# EAGLE design Black_Box_Sensor (EAGLE 9.6.2)
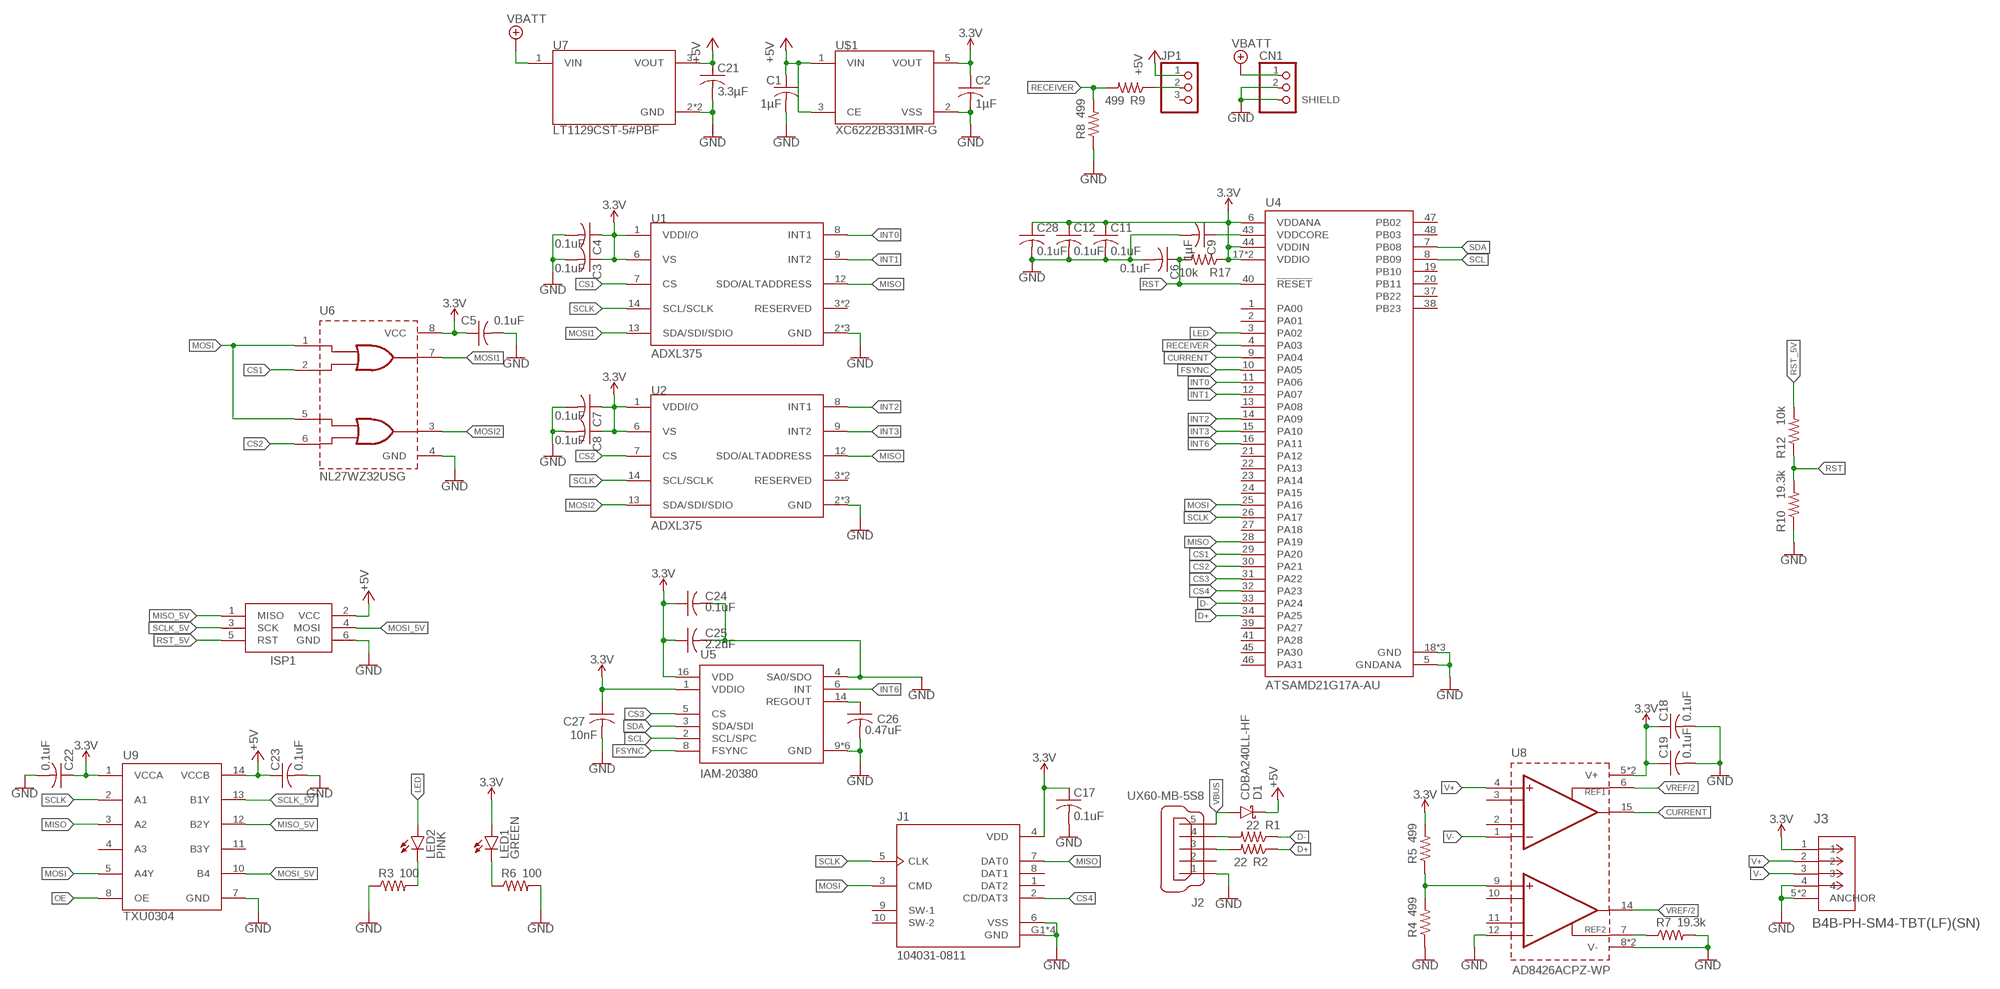
[diagram p0: schematic, sheet 1]

## Parts
C1  1µF  C-USC0603  [C0603]
C2  1µF  C-USC0603  [C0603]
C3  0.1uF  C-USC0603  [C0603]
C4  0.1uF  C-USC0603  [C0603]
C5  0.1uF  C-USC0603  [C0603]
C6  0.1uF  C-USC0603  [C0603]
C7  0.1uF  C-USC0603  [C0603]
C8  0.1uF  C-USC0603  [C0603]
C9  1µF  C-USC0603  [C0603]
C11  0.1uF  C-USC0603  [C0603]
C12  0.1uF  C-USC0603  [C0603]
C17  0.1uF  C-USC0603  [C0603]
C18  0.1uF  C-USC0603  [C0603]
C19  0.1uF  C-USC0603  [C0603]
C21  3.3µF  C-USC0603  [C0603]
C22  0.1uF  C-USC0603K  [C0603K]
C23  0.1uF  C-USC0603K  [C0603K]
C24  0.1uF  C-USC0603  [C0603]
C25  2.2uF  C-USC0603  [C0603]
C26  0.47uF  C-USC0603  [C0603]
C27  10nF  C-USC0603  [C0603]
C28  0.1uF  C-USC0603  [C0603]
CN1  JST_2PIN  [JST-PH-2-SMT]
D1  CDBA240LL-HF  [DIOM5225X250N]
ISP1  AVRISP-6  [AVRISP]
J1  104031-0811  [MOLEX_104031-0811]
J2  UX60-MB-5S8  [UX60-MB-5S8]
J3  B4B-PH-SM4-TBT(LF)(SN)  [CONN_B4B-PH-SM4-TB_JST]
JP1  PINHD-1X3  [1X03]
LED1  GREEN  LEDCHIP-LED0805  [CHIP-LED0805]
LED2  PINK  LEDKA-3528ASYC  [KA-3528ASYC]
R1  22  R-US_R0603  [R0603]
R2  22  R-US_R0603  [R0603]
R3  100  R-US_R0603  [R0603]
R4  499  R-US_R0603  [R0603]
R5  499  R-US_R0603  [R0603]
R6  100  R-US_R0603  [R0603]
R7  19.3k  R-US_R0603  [R0603]
R8  499  R-US_R0603  [R0603]
R9  499  R-US_R0603  [R0603]
R10  19.3k  R-US_R0603  [R0603]
R12  10k  R-US_R0603  [R0603]
R17  10k  R-US_R0603  [R0603]
U1  ADXL375  [14-VFLGA]
U2  ADXL375  [14-VFLGA]
U4  ATSAMD21G17A-AU  [TQFP48]
U5  IAM-20380  [PQFN50P300X300X80-16N]
U6  NL27WZ32USG  [US8]
U7  LT1129CST-5#PBF  [SOT-223-3]
U8  AD8426ACPZ-WP  [16LFCSP]
U9  TXU0304  [TSSOP14]
U$1  XC6222B331MR-G  [SOT-25]

## Nets
3.3V: C2.1 C3.1 C4.1 C5.1 C7.1 C8.1 C11.1 C12.1 C17.1 C18.1 C19.1 C22.1 C24.1 C25.1 C27.1 C28.1 J1.4(VDD) J3.1 LED1.A R5.2 R17.1 U1.1(VDDI/O) U1.6(VS) U2.1(VDDI/O) U2.6(VS) U4.6(VDDANA) U4.17(VDDIO) U4.36(VDDIO) U4.44(VDDIN) U5.1(VDDIO) U5.16(VDD) U6.8(VCC) U8.5(V+) U8.16(V+) U9.1(VCCA) U$1.5(VOUT)
+5V: C1.1 C21.1 C23.1 D1.C JP1.1 U7.3(VOUT) U9.14(VCCB) U$1.1(VIN) U$1.3(CE)
CS1: U1.7(CS) U4.29(PA20) U6.2(B1)
CS2: U2.7(CS) U4.30(PA21) U6.6(B2)
CS3: U4.31(PA22) U5.5(CS)
CS4: J1.2(CD/DAT3) U4.32(PA23)
CURRENT: U4.9(PA04) U8.15(OUTA)
D+: R2.1 U4.34(PA25)
D-: R1.1 U4.33(PA24)
FSYNC: U4.10(PA05) U5.8(FSYNC)
GND: C1.2 C2.2 C3.2 C4.2 C5.2 C6.2 C7.2 C8.2 C9.2 C11.2 C12.2 C17.2 C18.2 C19.2 C21.2 C22.2 C23.2 C24.2 C25.2 C26.2 C27.2 C28.2 CN1.2 CN1.NC1(SHIELD) CN1.NC2(SHIELD) ISP1.6(GND) J1.6(VSS) J1.G1(GND) J1.G2(GND) J1.G3(GND) J1.G4(GND) J2.1 J3.4 J3.5(ANCHOR) J3.6(ANCHOR) R3.1 R4.1 R6.2 R7.2 R8.1 R10.1 U1.2(GND) U1.4(GND) U1.5(GND) U2.2(GND) U2.4(GND) U2.5(GND) U4.5(GNDANA) U4.18(GND) U4.35(GND) U4.42(GND) U5.4(SA0/SDO) U5.9(GND) U5.10(GND) U5.11(GND) U5.12(GND) U5.13(GND) U5.15(GND) U6.4(GND) U7.2(GND) U7.4(GND) U8.8(V-) U8.12(INB-) U8.13(V-) U9.7(GND) U$1.2(VSS)
INT0: U1.8(INT1) U4.11(PA06)
INT1: U1.9(INT2) U4.12(PA07)
INT2: U2.8(INT1) U4.14(PA09)
INT3: U2.9(INT2) U4.15(PA10)
INT6: U4.16(PA11) U5.6(INT)
LED: LED2.A U4.3(PA02)
MISO: J1.7(DAT0) U1.12(SDO/ALTADDRESS) U2.12(SDO/ALTADDRESS) U4.28(PA19) U9.3(A2)
MISO_5V: ISP1.1(MISO) U9.12(B2Y)
MOSI: J1.3(CMD) U4.25(PA16) U6.1(A1) U6.5(A2) U9.5(A4Y)
MOSI1: U1.13(SDA/SDI/SDIO) U6.7(Y1)
MOSI2: U2.13(SDA/SDI/SDIO) U6.3(Y2)
MOSI_5V: ISP1.4(MOSI) U9.10(B4)
N$1: C9.1 U4.43(VDDCORE)
N$2: J2.3 R2.2
N$3: J2.4 R1.2
N$4: R4.2 R5.1 U8.9(INB+)
N$5: LED2.C R3.2
N$6: LED1.C R6.1
N$7: JP1.2 R9.1
N$8: R7.1 U8.7(REFB)
N$9: ISP1.2(VCC) ; supply symbol labelled +5V
N$10: C26.1 U5.14(REGOUT)
OE: U9.8(OE)
RECEIVER: R8.2 R9.2 U4.4(PA03)
RST: C6.1 R10.2 R12.1 R17.2 U4.40(!RESET!)
RST_5V: ISP1.5(RST) R12.2
SCL: U4.8(PB09) U5.2(SCL/SPC)
SCLK: J1.5(CLK) U1.14(SCL/SCLK) U2.14(SCL/SCLK) U4.26(PA17) U9.2(A1)
SCLK_5V: ISP1.3(SCK) U9.13(B1Y)
SDA: U4.7(PB08) U5.3(SDA/SDI)
V+: J3.2 U8.4(INA+)
V-: J3.3 U8.1(INA-)
VBATT: CN1.1 U7.1(VIN)
VBUS: D1.A J2.5
VREF/2: U8.6(REFA) U8.14(OUTB)
Unconnected: J1.1(DAT2) J1.8(DAT1) J1.9(SW-1) J1.10(SW-2) J2.2 JP1.3 U1.3(RESERVED) U1.11(RESERVED) U2.3(RESERVED) U2.11(RESERVED) U4.1(PA00) U4.2(PA01) U4.13(PA08) U4.19(PB10) U4.20(PB11) U4.21(PA12) U4.22(PA13) U4.23(PA14) U4.24(PA15) U4.27(PA18) U4.37(PB22) U4.38(PB23) U4.39(PA27) U4.41(PA28) U4.45(PA30) U4.46(PA31) U4.47(PB02) U4.48(PB03) U8.2(RGA-) U8.3(RGA+) U8.10(RGB+) U8.11(RGB-) U9.4(A3) U9.11(B3Y)

## Library data of the parts
C1 C2 C9 C21 = rcl:C-US: CAPACITOR, American symbol; DKPN: CC0603KRX7R6BB105; SPICEPREFIX: C; VOLTAGE: 10V
C3 C4 C6-C8 C11 C12 C17-C19 C24 C28 = rcl:C-US: CAPACITOR, American symbol; DKPN: CGA3E2X7R1E104K080AA; SPICEPREFIX: C
C5 C22 C23 = rcl:C-US: CAPACITOR, American symbol; SPICEPREFIX: C
C25 = rcl:C-US: CAPACITOR, American symbol; DKPN: C1608X5R1C225K080AB; SPICEPREFIX: C
C26 = rcl:C-US: CAPACITOR, American symbol; DKPN: C0603X5R0J474M030BC; SPICEPREFIX: C
C27 = rcl:C-US: CAPACITOR, American symbol; DKPN: C1608X7R2A103M080AA; SPICEPREFIX: C
CN1 = Hocki_Library:JST_2PIN: JST 2-Pin Connectors of various flavors SMT-RA (S2B-PH-SM4) 4UConnector #17311 SMT (B2B-PH-SM4) THM-RA (S2B-PH) THM (B2B-PH)
D1 = BBS_Library:CDBA240LL-HF: 40V, 2A Schottky diode with 1mA reverse leakage current and 350mV forward voltage. Datasheet <https://www.comchiptech.com/admin/files/product/CDBA240LL-HF%20RevD765674.pdf>; DKPN: 641-1698-1-ND
ISP1 = adafruit:AVRISP: AVR ISP HEADER Standard 6 pin header for AVR programming
J1 = BBS_Library:104031-0811: 10 (8 + 2) Position Card Connector Secure Digital - microSD™ Surface Mount, Right Angle Gold Datasheet <https://www.molex.com/pdm_docs/sd/1040310811_sd.pdf>; DKPN: WM6357CT-ND
J2 = BBS_Library:UX60*-MB-5S?: Description: USB - mini B USB 2.0 Receptacle Connector 5 Position, Right Angle Link SMD: Digi-Key <https://www.digikey.com/product-detail/en/hirose-electric-co-ltd/UX60A-MB-5ST/H2961CT-ND/597540> Link Through Hole: Digi-Key <https://www.digikey.com/products/en/connectors-interconnects/usb-dvi-hdmi-connectors/312?k=UX60-MB-5S8&k=&pkeyword=UX60-MB-5S8&sv=0&pv7=2&sf=0&quantity=&ColumnSort=0&page=1&pageSize=25>; DKPN: H2960CT-ND
J3 = BBS_Library:B4B-PH-SM4-TBT(LF)(SN): Connector Header Surface Mount 4 position 0.079" (2.00mm) DigiKey <https://www.digikey.com/en/products/detail/jst-sales-america-inc/B4B-PH-SM4-TBT-LF-SN/2217689?s=N4IgjCBcoBw1oDGUBmBDANgZwKYBoQB7KAbRACYAGAZjADYB2EAXQIAcAXKEAZQ4CcAlgDsA5iAC%2BBMAE4YMhCGSR02fEVIhKLdl0i8BI8VJABacouUCAruuKQyAVhYSTFhyABWWDgAI2ABY6IHSKggAm3KZglBC63CAEAI4cAJ7ccSBpbDjcaFjIrkA>; DKPN: 455-2873-1-ND
JP1 = pinhead:PINHD-1X3: PIN HEADER
LED1 = led:LED: LED OSRAM: - CHIPLED LG R971, LG N971, LY N971, LG Q971, LY Q971, LO R971, LY R971 LH N974, LH R974 LS Q976, LO Q976, LY Q976 LO Q996 - Hyper CHIPLED LW Q18S LB Q993, LB Q99A, LB R99A - SideLED LS A670, LO A670, LY A670, LG A670, LP A670 LB A673, LV A673, LT A673, LW A673 LH A674 LY A675 LS A676, LA A676, LO A676, LY A676, LW A676 LS A679, LY A679, LG A679 - Hyper Micro SIDELED® LS Y876, LA Y876, LO Y876, LY Y876 LT Y87S - SmartLED LW L88C, LW L88S LB L89C, LB L89S, LG L890 LS L89K, LO L89K, LY L89K LS L896, LA L896, LO L896, LY L896 - TOPLED LS T670, LO T670, LY T670, LG T670, LP T670 LSG T670, LSP T670, LSY T670, LOP T670, LYG T670 LG T671, LOG T671, LSG T671 LB T673, LV T673, LT T673, LW T673 LH T674 LS T676, LA T676, LO T676, LY T676, LB T676, LH T676, LSB T676, LW T676 LB T67C, LV T67C, LT T67C, LS T67K, LO T67K, LY T67K, LW E67C LS E67B, LA E67B, LO E67B, LY E67B, LB E67C, LV E67C, LT E67C LW T67C LS T679, LY T679, LG T679 LS T770, LO T770, LY T770, LG T770, LP T770 LB T773, LV T773, LT T773, LW T773 LH T774 LS E675, LA E675, LY E675, LS T675 LS T776, LA T776, LO T776, LY T776, LB T776 LHGB T686 LT T68C, LB T68C - Hyper Mini TOPLED® LB M676 - Mini TOPLED Santana® LG M470 LS M47K, LO M47K, LY M47K Source: http://www.osram.convergy.de LUXEON: - LUMILED® LXK2-PW12-R00, LXK2-PW12-S00, LXK2-PW14-U00, LXK2-PW14-V00 LXK2-PM12-R00, LXK2-PM12-S00, LXK2-PM14-U00 LXK2-PE12-Q00, LXK2-PE12-R00, LXK2-PE12-S00, LXK2-PE14-T00, LXK2-PE14-U00 LXK2-PB12-K00, LXK2-PB12-L00, LXK2-PB12-M00, LXK2-PB14-N00, LXK2-PB14-P00, LXK2-PB14-Q00 LXK2-PR12-L00, LXK2-PR12-M00, LXK2-PR14-Q00, LXK2-PR14-R00 LXK2-PD12-Q00, LXK2-PD12-R00, LXK2-PD12-S00 LXK2-PH12-R00, LXK2-PH12-S00 LXK2-PL12-P00, LXK2-PL12-Q00, LXK2-PL12-R00 Source: www.luxeon.com KINGBRIGHT: KA-3528ASYC Source: www.kingbright.com; DJKPN: 3372-0805YGBD008S01TR-ND
LED2 = led:LED: LED OSRAM: - CHIPLED LG R971, LG N971, LY N971, LG Q971, LY Q971, LO R971, LY R971 LH N974, LH R974 LS Q976, LO Q976, LY Q976 LO Q996 - Hyper CHIPLED LW Q18S LB Q993, LB Q99A, LB R99A - SideLED LS A670, LO A670, LY A670, LG A670, LP A670 LB A673, LV A673, LT A673, LW A673 LH A674 LY A675 LS A676, LA A676, LO A676, LY A676, LW A676 LS A679, LY A679, LG A679 - Hyper Micro SIDELED® LS Y876, LA Y876, LO Y876, LY Y876 LT Y87S - SmartLED LW L88C, LW L88S LB L89C, LB L89S, LG L890 LS L89K, LO L89K, LY L89K LS L896, LA L896, LO L896, LY L896 - TOPLED LS T670, LO T670, LY T670, LG T670, LP T670 LSG T670, LSP T670, LSY T670, LOP T670, LYG T670 LG T671, LOG T671, LSG T671 LB T673, LV T673, LT T673, LW T673 LH T674 LS T676, LA T676, LO T676, LY T676, LB T676, LH T676, LSB T676, LW T676 LB T67C, LV T67C, LT T67C, LS T67K, LO T67K, LY T67K, LW E67C LS E67B, LA E67B, LO E67B, LY E67B, LB E67C, LV E67C, LT E67C LW T67C LS T679, LY T679, LG T679 LS T770, LO T770, LY T770, LG T770, LP T770 LB T773, LV T773, LT T773, LW T773 LH T774 LS E675, LA E675, LY E675, LS T675 LS T776, LA T776, LO T776, LY T776, LB T776 LHGB T686 LT T68C, LB T68C - Hyper Mini TOPLED® LB M676 - Mini TOPLED Santana® LG M470 LS M47K, LO M47K, LY M47K Source: http://www.osram.convergy.de LUXEON: - LUMILED® LXK2-PW12-R00, LXK2-PW12-S00, LXK2-PW14-U00, LXK2-PW14-V00 LXK2-PM12-R00, LXK2-PM12-S00, LXK2-PM14-U00 LXK2-PE12-Q00, LXK2-PE12-R00, LXK2-PE12-S00, LXK2-PE14-T00, LXK2-PE14-U00 LXK2-PB12-K00, LXK2-PB12-L00, LXK2-PB12-M00, LXK2-PB14-N00, LXK2-PB14-P00, LXK2-PB14-Q00 LXK2-PR12-L00, LXK2-PR12-M00, LXK2-PR14-Q00, LXK2-PR14-R00 LXK2-PD12-Q00, LXK2-PD12-R00, LXK2-PD12-S00 LXK2-PH12-R00, LXK2-PH12-S00 LXK2-PL12-P00, LXK2-PL12-Q00, LXK2-PL12-R00 Source: www.luxeon.com KINGBRIGHT: KA-3528ASYC Source: www.kingbright.com; DJKPN: 754-1534-1-ND
R1 R2 R4 R5 R7-R10 R12 R17 = rcl:R-US_: RESISTOR, American symbol; SPICEPREFIX: R
R3 R6 = rcl:R-US_: RESISTOR, American symbol; DJKPN: 118-CR0603AFX-1000ELFCT-ND; SPICEPREFIX: R
U1 U2 = BBS_Library:ADXL375: Accelerometer X, Y, Z Axis ±200g 0.05Hz ~ 1.6kHz 14-LGA (3x5) Digikey <https://www.digikey.com/en/products/detail/analog-devices-inc/ADXL375BCCZ-RL7/4376405>; DKPN: ADXL375BCCZ-RL7CT-ND
U4 = BBS_Library:ATSAMD21G17A: ARM-Based Microcontroller; CENTROID_NOT_SPECIFIED: No; DATASHEET: http://www.atmel.com/images/atmel-42181-sam-d21_datasheet.pdf; DIGIKEY_DESCRIPTION: IC MCU 32BIT 128KB FLASH 48TQFP; DIGIKEY_PART_NUMBER: 1611-ATSAMD21G17A-AU-ND; LEAD_FREE: yes; MF: Microchip Technology / Atmel; MOUSER_PART_NUMBER: 556-ATSAMD21G17A-AU; MPN: ATSAMD21G17A-AU; PACKAGE: TQFP48; PREFIX: U; RECOMMENDED_LAND_PATTERN: http://www.atmel.com/Images/Atmel-8826-SEEPROM-PCB-Mounting-Guidelines-Surface-Mount-Packages-ApplicationNote.pdf; ROHS: yes; TEMPERATURE_RANGE_HIGH: +85°C; TEMPERATURE_RANGE_LOW: -40°C; VOLTAGE: 3.6V
U5 = BBS_Library:IAM-20380: Gyroscope X (Pitch), Y (Roll), Z (Yaw) ±250, 500, 1000, 2000 27kHz I²C, SPI 16-LGA (3x3) VDD = 1.8V Datasheet <https://invensense.tdk.com/wp-content/uploads/2017/11/DS-000195-IAM-20380_v1.0-Typ.pdf?ref_disty=digikey>; DKPN: 1428-1153-2-ND
U6 = Hocki_Library:NL27WZ32USG: OR Gate IC 2 Channel US8 DigiKey <https://www.digikey.com/product-detail/en/on-semiconductor/NL27WZ32USG/NL27WZ32USGOSCT-ND/964591>; DKPN: NL27WZ32USGOSCT-ND
U7 = BBS_Library:LT1129CST-*#PBF: Linear Voltage Regulator IC Positive Fixed 1 Output 700mA SOT-223-5 Datasheet <https://www.analog.com/media/en/technical-documentation/data-sheets/112935ff.pdf>; DKPN: LT1129CST-5#PBF-ND
U8 = BBS_Library:AD8426ACPZ-WP: IC INST AMP 2 CIRCUIT 16LFCSP DigiKey <https://www.digikey.com/en/products/detail/analog-devices-inc/AD8426ACPZ-WP/2742222>; DKPN: AD8426ACPZ-WP-ND
U9 = BBS_Library:TXU0304: Voltage Level Translator Unidirectional 1 Circuit 4 Channel 200Mbps 14-WQFN (3x2.5) https://www.ti.com/lit/ds/symlink/txu0304.pdf?ts=1646321006193&ref_url=https%253A%252F%252Fwww.mouser.com%252F; DKPN: 296-TXU0304BQARCT-ND
U$1 = BBS_Library:XC6222B331MR-G: Linear Voltage Regulator IC Positive Fixed 3.3V Output 700mA SOT-25-5

## Board
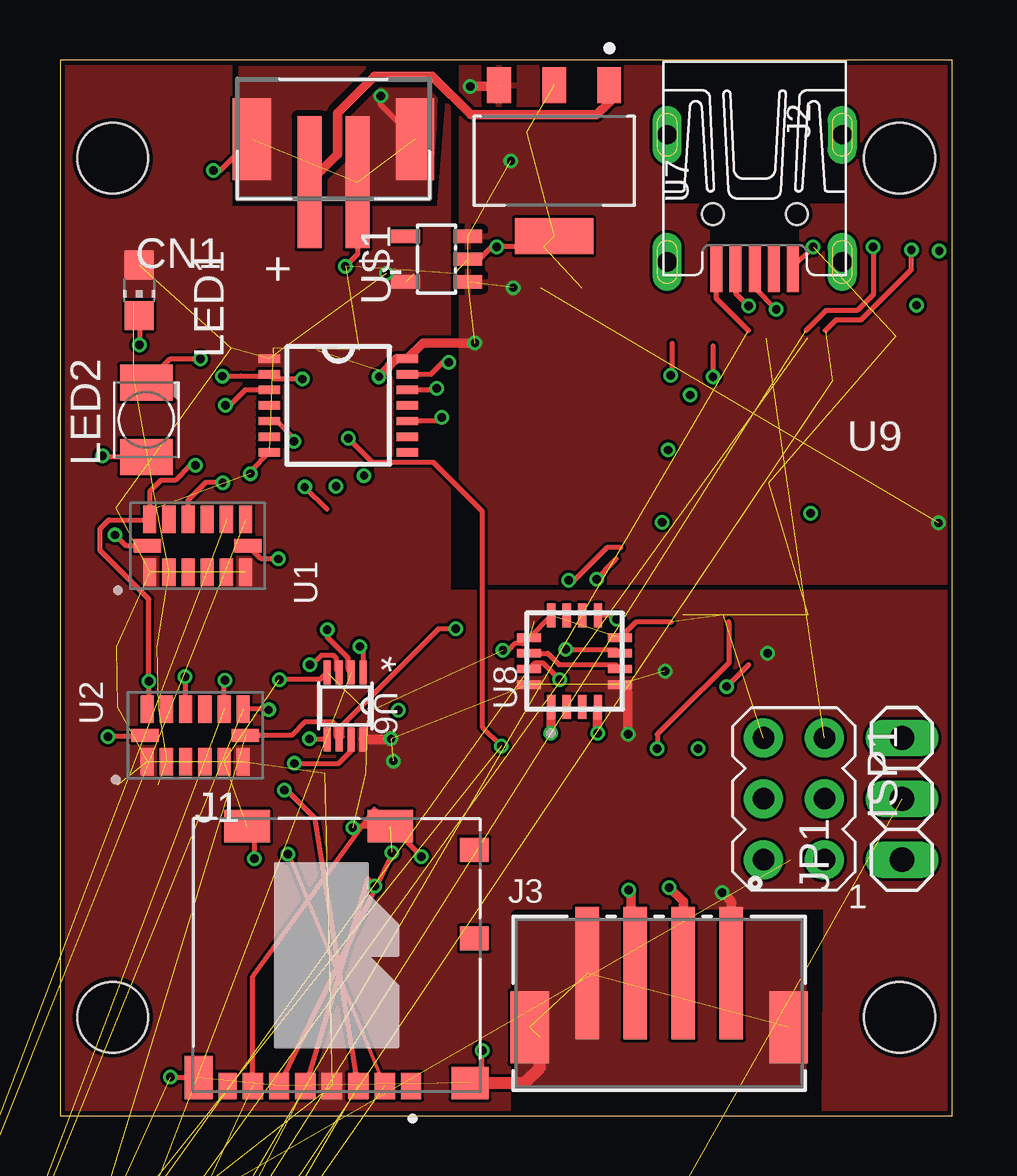
[diagram p1: board, top side]
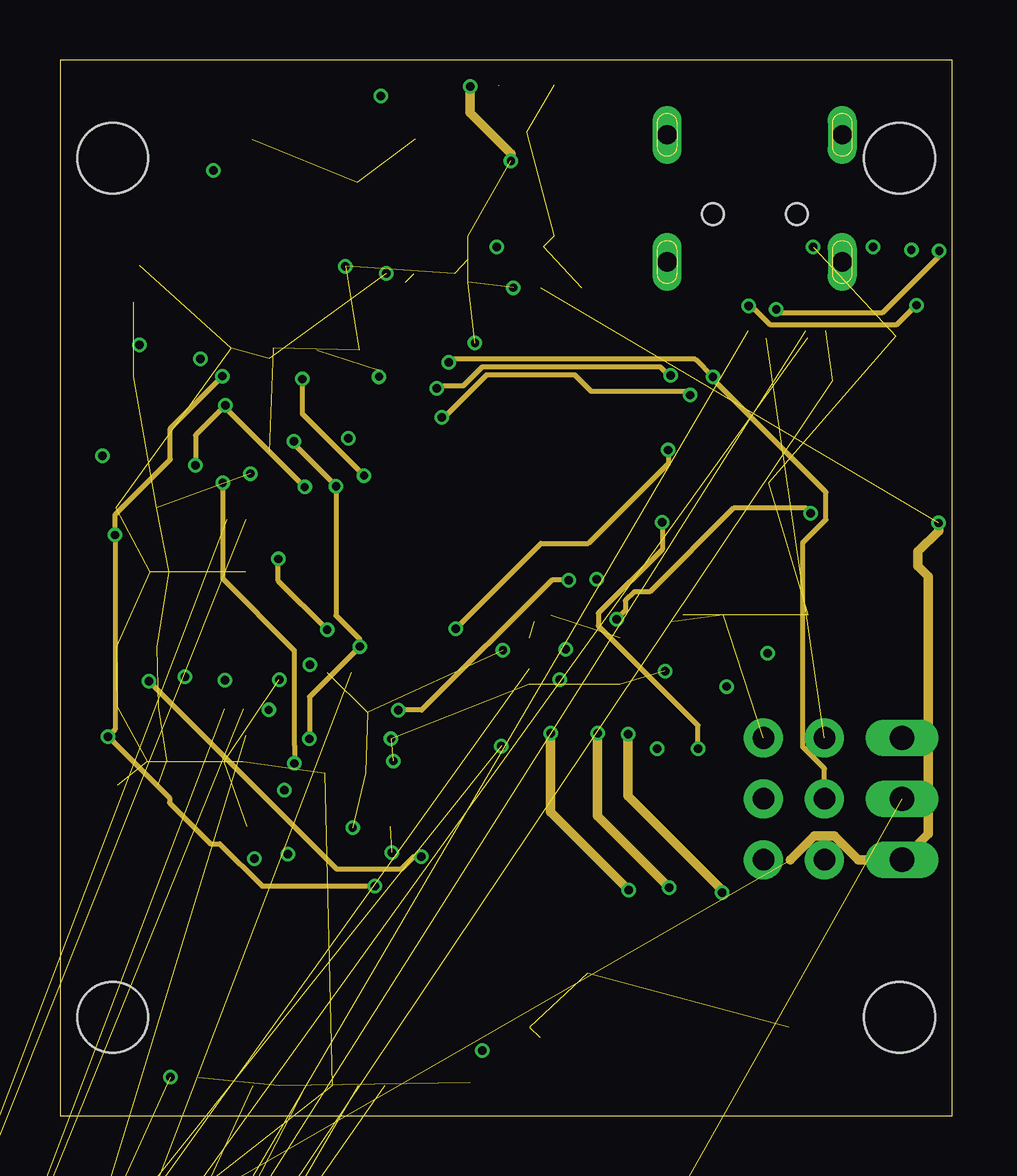
[diagram p2: board, inner layer Route2]
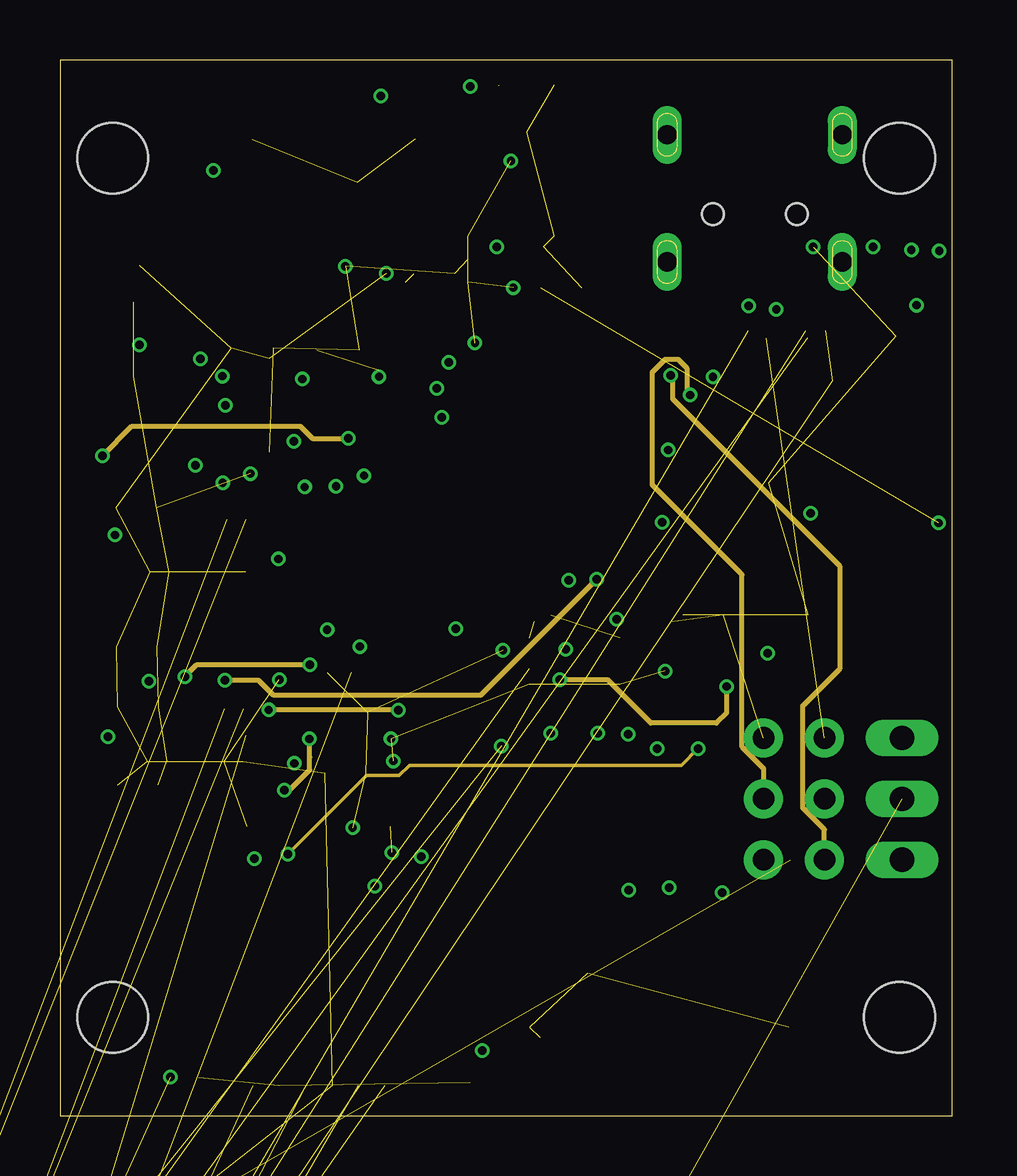
[diagram p3: board, inner layer Route15]
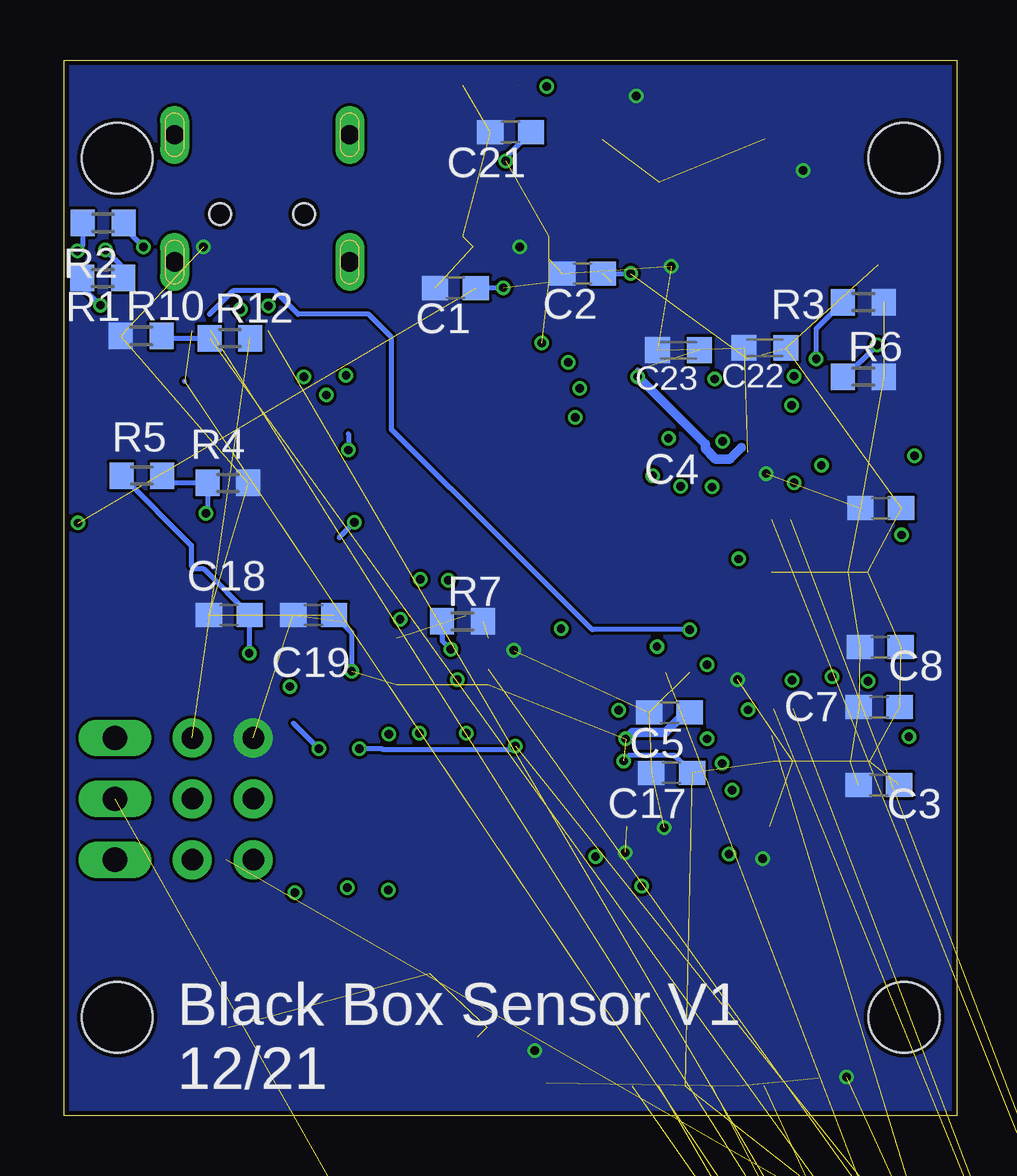
[diagram p4: board, bottom side, seen from below]

Size 37.2 x 44 mm. Coordinates in mm from the lower left corner, seen from the top.
Outline: 0,0 37.2,0 37.2,44 0,44 0,0
Copper layers (1+2*15+16): Top 0.035mm / dielectric 0.2mm / Route2 0.0175mm / dielectric 1.065mm / Route15 0.0175mm / dielectric 0.2mm / Bottom 0.035mm
Design rules "JLCPCB (4 Layer)": minimum track width 5mil, minimum drill 0.2mm, track to track 5mil, track to pad 5mil, pad to pad 5mil, via to via 20mil, smd to smd 5mil, copper to edge 0.2mm, drill to drill 21mil, minimum pad ring 6mil, minimum via ring 5mil, stop-mask expansion 2mil, vias tented up to drill 30mil, thermal gap 10mil
Holes 2.95 mm at 2.2,39.9 35,39.9 35,4.1 2.2,4.1

### Footprints (pad centres in the part's own frame; a part is rotated, then mirrored left to right if it is on the bottom)
C0603 = smd 1.1 x 1: 1 -0.85,0; 2 0.85,0
C0603K = smd 1.05 x 1.08: 1 -0.875,0; 2 0.875,0
JST-PH-2-SMT = smd 1 x 5.5: 1 -1,-1.8; 2 1,-1.8 | smd 1.6 x 3.4: NC1 -3.4,0; NC2 3.4,0
DIOM5225X250N = smd 2.43 x 1.61: A 2.135,0; C -2.135,0
AVRISP = drill 0.9 pad 1.626: 1 -1.27,2.54; 2 1.27,2.54; 3 -1.27,0; 4 1.27,0; 5 -1.27,-2.54; 6 1.27,-2.54
MOLEX_104031-0811 = smd 0.85 x 1.1: 1 3.105,-5.45; 2 2.005,-5.45; 3 0.905,-5.45; 4 -0.195,-5.45; 5 -1.295,-5.45; 6 -2.395,-5.45; 7 -3.495,-5.45 | smd 0.75 x 1.1: 8 -4.545,-5.45 | smd 1.2 x 1: 9 5.74,0.7; 10 5.74,4.4 | smd 1.55 x 1.35: G1 5.565,-5.325 | smd 1.17 x 1.8: G2 -5.755,-5.1 | smd 1.9 x 1.35: G3 -3.73,5.375; G4 2.24,5.375
UX60-MB-5S8 = smd 2 x 0.5: 1 8.65,1.6; 2 8.65,0.8; 3 8.65,0; 4 8.65,-0.8; 5 8.65,-1.6 | drill 0.8 long: M1 3.1,-3.65; M2 3.1,3.65; M3 8.4,3.65; M4 8.4,-3.65 | hole 0.9: 6.4,-1.75; 6.4,1.75
CONN_B4B-PH-SM4-TB_JST = smd 0.991 x 5.512: 1 3,1.255; 2 1,1.255; 3 -1,1.255; 4 -3,1.255 | smd 1.6 x 2.997: 5 -5.4,-0.995; 6 5.4,-0.995
1X03 = drill 1.016 long: 1 -2.54,0; 2 0,0; 3 2.54,0
CHIP-LED0805 = smd 1.2 x 1.2: A 0,-1.05; C 0,1.05
KA-3528ASYC = smd 1.5 x 2.2: A -1.55,0; C 1.55,0
R0603 = smd 1 x 1.1: 1 -0.85,0; 2 0.85,0
14-VFLGA = smd 1.145 x 0.55: 1 -1.097,2; 2 -1.097,1.2; 3 -1.097,0.4; 4 -1.097,-0.4; 5 -1.097,-1.2; 6 -1.097,-2; 8 1.097,-2; 9 1.097,-1.2; 10 1.097,-0.4; 11 1.097,1.2; 12 1.097,2; 13 1.097,0.4 | smd 0.55 x 1.145: 7 0,-2.098; 14 0,2.098
TQFP48 = smd 1.5 x 0.3: 1 -4.2,2.75; 2 -4.2,2.25; 3 -4.2,1.75; 4 -4.2,1.25; 5 -4.2,0.75; 6 -4.2,0.25; 7 -4.2,-0.25; 8 -4.2,-0.75; 9 -4.2,-1.25; 10 -4.2,-1.75; 11 -4.2,-2.25; 12 -4.2,-2.75; 25 4.2,-2.75; 26 4.2,-2.25; 27 4.2,-1.75; 28 4.2,-1.25; 29 4.2,-0.75; 30 4.2,-0.25; 31 4.2,0.25; 32 4.2,0.75; 33 4.2,1.25; 34 4.2,1.75; 35 4.2,2.25; 36 4.2,2.75 | smd 0.3 x 1.5: 13 -2.75,-4.2; 14 -2.25,-4.2; 15 -1.75,-4.2; 16 -1.25,-4.2; 17 -0.75,-4.2; 18 -0.25,-4.2; 19 0.25,-4.2; 20 0.75,-4.2; 21 1.25,-4.2; 22 1.75,-4.2; 23 2.25,-4.2; 24 2.75,-4.2; 37 2.75,4.2; 38 2.25,4.2; 39 1.75,4.2; 40 1.25,4.2; 41 0.75,4.2; 42 0.25,4.2; 43 -0.25,4.2; 44 -0.75,4.2; 45 -1.25,4.2; 46 -1.75,4.2; 47 -2.25,4.2; 48 -2.75,4.2
PQFN50P300X300X80-16N = smd 0.49 x 0.35: 1 -1.26,1; 2 -1.26,0.5; 3 -1.26,0; 4 -1.26,-0.5; 5 -1.26,-1; 9 1.26,-1; 10 1.26,-0.5; 11 1.26,0; 12 1.26,0.5; 13 1.26,1 | smd 0.35 x 0.49: 6 -0.5,-1.26; 7 0,-1.26; 8 0.5,-1.26; 14 0.5,1.26; 15 0,1.26; 16 -0.5,1.26
US8 = smd 1 x 0.3: 1 -1.4,0.75; 2 -1.4,0.25; 3 -1.4,-0.25; 4 -1.4,-0.75; 5 1.4,-0.75; 6 1.4,-0.25; 7 1.4,0.25; 8 1.4,0.75
SOT-223-3 = smd 1.499 x 0.991: 1 -3.15,2.299; 2 -3.15,0; 3 -3.15,-2.299 | smd 1.499 x 3.277: 4 3.15,0
16LFCSP = smd 1 x 0.35: 1 -1.9,0.975; 2 -1.9,0.325; 3 -1.9,-0.325; 4 -1.9,-0.975; 9 1.9,-0.975; 10 1.9,-0.325; 11 1.9,0.325; 12 1.9,0.975 | smd 0.35 x 1: 5 -0.975,-1.9; 6 -0.325,-1.9; 7 0.325,-1.9; 8 0.975,-1.9; 13 0.975,1.9; 14 0.325,1.9; 15 -0.325,1.9; 16 -0.975,1.9
TSSOP14 = smd 0.9 x 0.35: 1 -2.875,1.95; 2 -2.875,1.3; 3 -2.875,0.65; 4 -2.875,0; 5 -2.875,-0.65; 6 -2.875,-1.3; 7 -2.875,-1.95; 8 2.875,-1.95; 9 2.875,-1.3; 10 2.875,-0.65; 11 2.875,0; 12 2.875,0.65; 13 2.875,1.3; 14 2.875,1.95
SOT-25 = smd 0.55 x 1.2: 1 -0.95,-1.3; 2 0,-1.3; 3 0.95,-1.3; 4 0.95,1.3; 5 -0.95,1.3

### Placement (x,y rotation side)
C1  20.9,34.5 180 bottom
C2  15.6,35.1 180 bottom
C3  3.25,13.78 180 bottom
C4  3.17,25.32 180 bottom
C5  11.98,16.8 180 bottom
C6  -13.7,-60.1 0 top  (outside the outline)
C7  3.24,17.03 180 bottom
C8  3.19,19.53 180 bottom
C9  -13.7,-65 0 top  (outside the outline)
C11  -13.7,-40.5 0 top  (outside the outline)
C12  -13.7,-45.4 0 top  (outside the outline)
C17  11.89,14.29 180 bottom
C18  30.33,20.87 180 bottom
C19  26.81,20.87 180 bottom
C21  18.6,41 180 bottom
C22  8,32 180 bottom
C23  11.6,31.9 180 bottom
C24  -2.8,-16 0 top  (outside the outline)
C25  -2.8,-20.9 0 top  (outside the outline)
C26  -2.8,-25.8 0 top  (outside the outline)
C27  -2.8,-30.7 0 top  (outside the outline)
C28  -13.7,-50.3 0 top  (outside the outline)
CN1  11.4,40.7 0 top
D1  4,-5.8 0 top  (outside the outline)
ISP1  30.6,13.2 180 top
J1  11.53,6.68 0 top
J2  28.96,43.98 270 top
J3  24.98,4.68 0 top
JP1  35.1,13.2 90 top
LED1  3.3,34.4 180 top
LED2  3.6,29 90 top
R1  35.6,34.91 180 bottom
R2  35.59,37.21 180 bottom
R3  3.9,33.9 180 bottom
R4  30.39,26.37 180 bottom
R5  33.97,26.67 180 bottom
R6  3.9,30.8 0 bottom
R7  20.6,20.6 0 bottom
R8  -13.7,-69.9 0 top  (outside the outline)
R9  -13.7,-74.8 0 top  (outside the outline)
R10  34,32.5 0 bottom
R12  30.3,32.4 0 bottom
R17  -13.7,-55.2 0 top  (outside the outline)
U1  5.74,23.75 90 top
U2  5.64,15.85 90 top
U4  -9.5,-26.5 0 top  (outside the outline)
U5  -1.8,-10.7 0 top  (outside the outline)
U6  11.89,17.07 270 top
U7  20.6,39.8 270 top
U8  21.45,18.94 90 top
U9  11.6,29.6 0 top
U$1  15.7,35.7 90 top

### Tracks (layer width: path | path; a pad name or v marks a point on that pad's centre or on a via)
3.3V  (via drill 0.35)  (32 unrouted)
  Top 0.4: U8.5 23.68,17.64 v23.68,15.9 | v27.6,9.3 27.98,8.92 J3.1 | U6.8 13.77,15.67 v13.8,15.7
  Route2 0.4: v23.68,15.9 23.68,13.32 27.6,9.4 v27.6,9.3
  Bottom 0.2: C19.1 25.23,20.14 v25.23,18.53 | R5.2 31.92,23.77 31.92,22.93 31.78,22.79 31.4,22.79 C18.1 29.5,20.85 v29.5,19.27 | C17.1 11.77,15.02 13.65,15.02 v13.89,14.78 | C2.1 v13.6,35.1
  Bottom 0.4: v13.8,15.7 13.53,15.97 12.14,15.97 11.32,16.8 C5.1
  pour Top (no thermals): 0,44 0,0 18.7,0 18.7,8.5 18.9,8.7 31.9,8.7 31.85,0 37.2,0 37.2,21.8 16.2,21.8 16.2,42.76 15.8,37.8 7.1,37.8 7.1,44
+5V  (via drill 0.35)  (8 unrouted)
  Top 0.4: v13.3,30.8 13.7,31.2 13.7,31.21 14.04,31.55 U9.14 15.12,32.2 v17.3,32.2 | v17.1,42.9 18.29,42.9 18.29,42.94
  Route2 0.4: 30.45,10.66 31.45,11.66 32.28,11.66 33.29,10.66 JP1.1 36.19,11.75 36.19,22.48 35.77,22.9 35.77,23.5 36.63,24.36 v36.63,24.7 | v17.1,42.9 17.1,41.8 18.8,40.1 v18.8,39.8
  Bottom 0.152: C1.1
  Bottom 0.2: C21.1 18.8,39.95 v18.8,39.8 | 13.3,31.07 v13.3,30.8 | C1.1 v18.9,34.51
  Bottom 0.4: v13.3,30.8 10.49,27.99 10.49,27.8 10.06,27.37 9.45,27.37 8.98,27.84
  pour Top: 16.7,44 16.7,22.2 37.2,22.2 37.2,44
CS1  (via drill 0.35)  (1 unrouted)
  Top 0.2: U6.2 12.02,18.59 12.02,19.06 11.14,19.94 v11.14,20.25 | v9.1,23.2 8.39,23.2 U1.7
  Route2 0.2: v11.14,20.25 9.1,22.29 v9.1,23.2
  Bottom 0.2: v11.14,20.25 15.2,20.25 21.08,26.13 21.1,26.13 23.57,28.6 23.57,32.44 24.53,33.4 27.46,33.4 28.44,34.38 30.17,34.38 31.15,33.4
CS2  (via drill 0.35)  (1 unrouted)
  Top 0.2: U2.7 9.66,15.85 10.21,16.4 11.38,16.4 11.52,16.26 11.52,15.79 U6.6 11.76,15.79 11.76,16.26 15.8,20.3 v16.5,20.3
  Route2 0.2: v16.5,20.3 20.05,23.85 22.03,23.85 25.36,27.18 v25.36,27.74
  Bottom 0.2: 25.36,28.41 v25.36,27.74
CS3  (1 unrouted)
CS4  (via drill 0.35)  (1 unrouted)
  Top 0.152: J1.2 9.53,10.93 v9.5,10.9
  Route2 0.2: v25.11,24.73 25.11,23.6 22.45,20.94 22.45,20.42 26.6,16.26 v26.6,15.3
  Route15 0.152: v9.5,10.9 12.77,14.17 14.14,14.17 14.57,14.6 25.9,14.6 v26.6,15.3
  Bottom 0.2: 25.75,24.09 v25.11,24.73 | 27.65,16.35 v26.6,15.3
CURRENT  (via drill 0.35)  (1 unrouted)
  Top 0.2: U8.15 19.8,18.86 20.14,18.86 v20.83,18.17 | 28.7,18.79 v27.8,17.89
  Route15 0.2: v20.83,18.17 22.82,18.17 24.63,16.36 27.37,16.36 27.8,16.79 v27.8,17.89
D+  (via drill 0.35)  (1 unrouted)
  Top 0.2: 31.1,32.72 31.93,33.55 33.24,33.55 33.9,34.22 v33.9,36.2
  Bottom 0.2: R2.1 34.74,37.04 v33.9,36.2
D-  (via drill 0.35)  (2 unrouted)
  Top 0.2: 31.9,32.72 32.36,33.18 33.4,33.18 35.49,35.27 v35.49,36.08
  Bottom 0.2: 32.19,30.61 32.2,30.6 | 35.08,34.91 R1.1 34.53,35.13 v35.49,36.08
FSYNC  (1 unrouted)
GND  (via drill 0.35)  (64 unrouted)
  Top 0.152: U$1.2
  Top 0.2: v31.4,36.2 30.56,35.36 J2.1 | CN1.2 12.4,35.9 v11.9,35.4 | CN1.NC1 6.7,39.4 v6.4,39.4 | CN1.NC2 13.37,42.13 v13.37,42.5 | J1.G2 4.62,1.58 v4.6,1.6 | J1.6 13.93,11.05 v13.83,10.96 | U6.4 10.84,18.17 v9.14,18.17 | J1.G3 8.06,11.71 8.1,11.7 v8.1,10.7 | J1.G1 17.6,1.35 v17.6,2.7 | U8.8 24,20.57 25.47,20.57 | U8.12 U8.13 19.3,19.67 18.96,19.67 18.68,19.39 v18.47,19.39 | v12.2,12 12.2,12.05 J1.G4 | U9.7 7.94,26.87 v7.94,26.76 | 20.17,36.22 v18.22,36.22 18.02,36.22 17.51,35.71 U$1.2
  Top 0.5: J1.G1 19.36,1.35 20,2 20,3.27
  pour Bottom (no thermals): 0,0 0,44 37.2,44 37.2,0
  pour Top (isolate 0.254, rank 3, no thermals): 7.34,43.8 7.34,38.16 7.4,38.1 15.5,38.1 15.7,43.8
  pour Top (no thermals): 19.1,8.1 30.9,8.1 31,8 31,1.3 30.8,1.1 19.1,1.1
INT0  (1 unrouted)
INT1  (1 unrouted)
INT2  (via drill 0.35)  (1 unrouted)
  Top 0.2: v21.2,22.32 21.45,22.32 22.81,23.68 23.38,23.68 | v8.7,16.91 8.66,16.95 U2.8
  Route2 0.2: v21.2,22.32 20.5,22.32 15.08,16.9 v14.1,16.9
  Route15 0.2: v14.1,16.9 v8.71,16.9 v8.7,16.91
INT3  (via drill 0.35)  (1 unrouted)
  Top 0.2: U2.9 6.84,18.12 v6.87,18.15 | v22.37,22.35 22.72,22.7 22.72,22.74 23.18,23.2
  Route15 0.2: v6.87,18.15 8.27,18.15 8.88,17.54 17.56,17.54 v22.37,22.35
INT6  (1 unrouted)
LED  (via drill 0.35)  (1 unrouted)
  Top 0.2: v18.4,15.4 17.6,16.2 17.6,25.19 15.56,27.23 13.01,27.23 v12.02,28.22 | v24.9,15.3 24.9,15.9 26.77,17.77 26.77,17.75 27.88,18.86 27.88,20.58 | LED2.A 1.82,27.45 v1.77,27.5
  Route15 0.2: v12.02,28.22 10.53,28.22 10.02,28.73 3,28.73 v1.77,27.5
  Bottom 0.2: v24.9,15.3 23.97,15.3 23.94,15.27 18.53,15.27 v18.4,15.4
MISO  (via drill 0.35)  (1 unrouted)
  Top 0.2: v6.89,29.6 7.07,29.6 7.71,30.25 U9.3 | v10.2,26.2 11.12,25.27 | J1.7 8.04,5.8 13.1,12.76 v15.06,10.8 | U2.12 3.7,17.01 v3.7,18.11 3.7,21.52 1.67,23.55 1.67,24.46 2.04,24.83 3.72,24.83 U1.12 3.74,26.01 4.2,26.47 4.79,26.47 5.43,27.11 v5.65,27.11
  Route2 0.2: v5.65,27.11 5.65,28.36 v6.89,29.6 6.89,29.51 v10.2,26.2 | v15.06,10.8 14.75,10.8 14.22,10.27 11.54,10.27 v3.7,18.11
MISO_5V  (via drill 0.35)
  Top 0.2: 25.52,32.18 25.52,30.92 v25.46,30.86 | v15.71,30.31 15.65,30.25 U9.12
  Route2 0.2: v15.71,30.31 15.81,30.41 16.81,30.41 17.6,31.2 25.03,31.2 25.37,30.86 v25.46,30.86
  Route15 0.2: ISP1.1 31.87,11.92 30.97,12.83 30.97,17.08 32.53,18.64 32.53,22.89 25.55,29.87 25.55,30.77 v25.46,30.86
MOSI  (via drill 0.35)  (1 unrouted)
  Top 0.2: v11.52,26.24 v11.51,26.24 | v9.76,28.1 9.7,28.15 9.7,28.27 9.02,28.95 U9.5 | v12.5,19.55 12.64,19.41 U6.1 | v10.4,15.7 11.11,15.7 U6.5 | J1.3 10.62,12.39 9.58,13.44 9.48,13.44 v9.36,13.56
  Route2 0.2: v9.76,28.1 9.76,27.99 v11.51,26.24 11.51,20.84 12.5,19.85 v12.5,19.55 10.4,17.45 v10.4,15.7
  Route15 0.2: v9.36,13.56 9.45,13.47 9.46,13.47 10.41,14.42 10.41,14.94 10.4,14.95 v10.4,15.7
MOSI1  (via drill 0.35)
  Top 0.2: U1.13 5.34,25.65 6.07,26.38 v6.78,26.38 | v9.78,14.68 11.62,14.68 12.14,15.2 U6.7
  Route2 0.2: v9.78,14.68 9.78,15.43 9.77,15.44 9.77,19.39 6.78,22.38 v6.78,26.38
MOSI2  (via drill 0.35)
  Top 0.2: U2.13 5.24,18.26 v5.2,18.3 | U6.3 11.52,18.59 11.52,19.06 11.38,19.2 10.9,19.2 10.5,18.8 v10.41,18.8
  Route15 0.2: v5.2,18.3 5.7,18.8 v10.41,18.8
MOSI_5V  (via drill 0.35)
  Top 0.2: 26.3,30.06 v26.28,30.03 | v15.91,29.11 15.76,28.96 15.77,28.95 U9.10
  Route2 0.2: v15.91,29.11 15.96,29.06 17.77,30.87 21.46,30.87 22.15,30.18 26.13,30.18 v26.28,30.03
  Route15 0.2: v26.28,30.03 26.13,30.18 26.13,31.16 25.76,31.53 25.24,31.53 24.69,30.98 24.69,26.28 28.43,22.54 28.43,15.37 29.33,14.46 ISP1.4
N$1  (1 unrouted)
N$2  (via drill 0.35)
  Top 0.2: v29.86,33.6 28.96,34.5 J2.3
  Route2 0.2: v29.86,33.6 30.01,33.45 34.28,33.45 36.66,35.83 v36.66,36.05
  Bottom 0.2: v36.66,36.05 36.44,36.26 R2.2
N$3  (via drill 0.35)
  Top 0.2: J2.4 28.16,34.29 v28.7,33.75
  Route2 0.2: v28.7,33.75 28.82,33.75 29.6,32.97 34.89,32.97 v35.7,33.78
  Bottom 0.2: 36.54,35 R1.2 36.45,34.53 v35.7,33.78
N$4  (via drill 0.35)
  Top 0.2: v23.21,20.69 23.06,20.84 U8.9
  Route2 0.2: v31.3,25.1 31.3,25.13 31.11,25.32 28.07,25.32 24.59,21.83 23.94,21.83 23.57,21.46 23.57,21.05 v23.21,20.69
  Bottom 0.2: R5.1 32.82,26.37 R4.2 31.24,25.16 v31.3,25.1
N$5  (via drill 0.35)
  Top 0.2: LED2.C 4.59,31.54 v5.86,31.54
  Bottom 0.2: v5.86,31.54 5.86,32.79 R3.2
N$6  (via drill 0.35)
  Top 0.2: LED1.C 3.32,33.33 v3.32,32.12
  Bottom 0.2: R6.1 4.64,30.8 v3.32,32.12
N$7  (1 unrouted)
N$8  (via drill 0.35)
  Top 0.2: v21.09,19.44 21.13,19.4 23.21,19.4 U8.7
  Bottom 0.2: R7.1 21.45,19.8 v21.09,19.44
N$10  (1 unrouted)
RECEIVER  (2 unrouted)
RST  (3 unrouted)
  Bottom 0.2: R10.2 33.05,32.4 R12.1
RST_5V  (1 unrouted)
SCL  (1 unrouted)
SCLK  (via drill 0.35)  (1 unrouted)
  Top 0.2: U1.14 2.75,23.75 v2.3,24.2 | v6.78,30.82 7.53,30.82 7.54,30.83 8.66,30.83 U9.2 8.93,30.7 v10.1,30.7 | v12.68,26.68 12.71,26.65 | U2.14 3.49,15.8 v2,15.8 | v13.13,9.57 12.82,9.87 J1.5
  Route2 0.2: v6.78,30.82 4.6,28.64 4.6,27.35 2.3,25.05 v2.3,24.2 2.3,16.1 v2,15.8 4.57,13.23 4.57,13.04 6.28,11.33 6.66,11.33 8.42,9.57 v13.13,9.57 | v10.1,30.7 10.1,29.25 v12.68,26.68
SCLK_5V  (via drill 0.35)
  Top 0.2: 27.22,32.08 v27.22,30.79 | v16.2,31.4 15.97,31.4 15.47,30.9 U9.13
  Route2 0.2: v16.2,31.4 16.34,31.53 26.48,31.53 v27.22,30.79 27.22,30.7 31.93,25.99 31.93,24.84 30.97,23.88 30.97,15.37 31.87,14.46 ISP1.3
SDA  (1 unrouted)
V+  (via drill 0.35)
  Top 0.4: U8.4 22.41,17.02 v22.41,15.93 | J3.2 25.98,8.92 v25.4,9.5
  Route2 0.4: v22.41,15.93 22.41,12.49 v25.4,9.5
V-  (via drill 0.35)
  Top 0.4: U8.1 20.48,15.97 v20.45,15.94 | v23.7,9.4 23.8,9.3 23.8,6.12 J3.3
  Route2 0.4: v20.45,15.94 20.45,12.65 v23.7,9.4
VBATT
  Top 0.4: CN1.1 11.57,40.07 11.57,41.78 13.12,43.33 15.51,43.33 17.14,41.71 22.37,41.71 22.9,42.24 U7.1
VBUS  (1 unrouted)
  Top 0.2: 28.7,32.72 27.36,34.06 J2.5
VREF/2
  Top 0.2: U8.6 23.16,18.8 20.8,18.8 20.34,19.27 U8.14

### Text on the board
bPlace: Black Box Sensor V1 / 12/21